# Altium schematic sheet Power tree.SchDoc
size A4; SheetNumber: 3; SheetTotal: 4
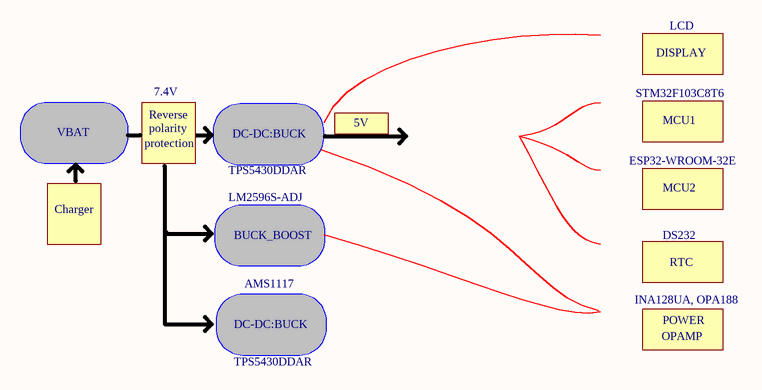
[diagram p0: Power tree.SchDoc]

## Notes on the sheet
- DISPLAY
- LCD
- VBAT
- protection
- Reverse
- polarity
- 7.4V
- DC-DC:BUCK
- 5V
- STM32F103C8T6
- MCU1
- Charger
- TPS5430DDAR
- LM2596S-ADJ
- ESP32-WROOM-32E
- MCU2
- BUCK_BOOST
- AMS1117
- DS232
- RTC
- INA128UA, OPA188
- OPAMP
- POWER